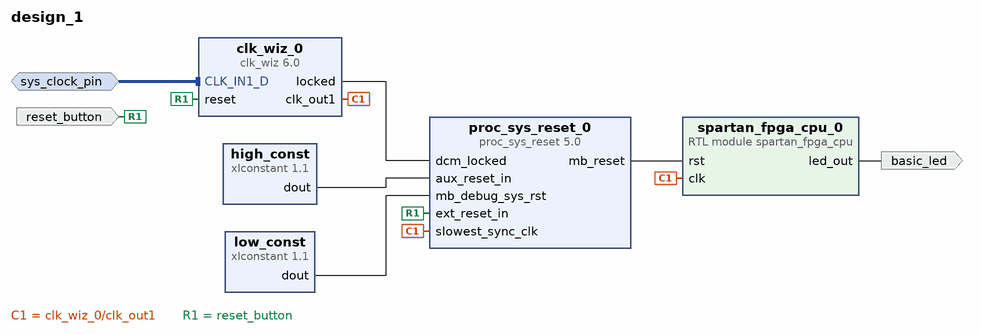
[diagram p0: block diagram of the top level]
# Vivado block design design_1, xc7s100fgga676-2, Vivado 2024.1
create_bd_design design_1

create_bd_intf_port -mode Slave -vlnv xilinx.com:interface:diff_clock_rtl:1.0 sys_clock_pin
set_property -dict {CONFIG.FREQ_HZ 200000000} [get_bd_intf_ports sys_clock_pin]
create_bd_port -dir I -type rst reset_button
set_property -dict {CONFIG.POLARITY ACTIVE_HIGH} [get_bd_ports reset_button]
create_bd_port -dir O basic_led

create_bd_cell -type module -reference spartan_fpga_cpu spartan_fpga_cpu_0
create_bd_cell -type ip -vlnv xilinx.com:ip:clk_wiz:6.0 clk_wiz_0
set_property -dict [list \
  CONFIG.CLK_IN1_BOARD_INTERFACE sys_diff_clock \
  CONFIG.RESET_BOARD_INTERFACE Custom \
  CONFIG.USE_BOARD_FLOW true \
] [get_bd_cells clk_wiz_0]
create_bd_cell -type ip -vlnv xilinx.com:ip:proc_sys_reset:5.0 proc_sys_reset_0
set_property -dict {CONFIG.RESET_BOARD_INTERFACE reset CONFIG.USE_BOARD_FLOW true} [get_bd_cells proc_sys_reset_0]
create_bd_cell -type ip -vlnv xilinx.com:ip:xlconstant:1.1 high_const
create_bd_cell -type ip -vlnv xilinx.com:ip:xlconstant:1.1 low_const
set_property -dict {CONFIG.CONST_VAL 0} [get_bd_cells low_const]

# ---- connections ----

connect_bd_intf_net -intf_net sys_diff_clock_1 [get_bd_intf_ports sys_clock_pin] [get_bd_intf_pins clk_wiz_0/CLK_IN1_D]
connect_bd_net [get_bd_pins clk_wiz_0/clk_out1] [get_bd_pins proc_sys_reset_0/slowest_sync_clk] [get_bd_pins spartan_fpga_cpu_0/clk]
connect_bd_net [get_bd_pins clk_wiz_0/locked] [get_bd_pins proc_sys_reset_0/dcm_locked]
connect_bd_net [get_bd_pins high_const/dout] [get_bd_pins proc_sys_reset_0/aux_reset_in]
connect_bd_net [get_bd_pins low_const/dout] [get_bd_pins proc_sys_reset_0/mb_debug_sys_rst]
connect_bd_net [get_bd_pins proc_sys_reset_0/mb_reset] [get_bd_pins spartan_fpga_cpu_0/rst]
connect_bd_net -net reset_1 [get_bd_ports reset_button] [get_bd_pins proc_sys_reset_0/ext_reset_in] [get_bd_pins clk_wiz_0/reset]
connect_bd_net [get_bd_pins spartan_fpga_cpu_0/led_out] [get_bd_ports basic_led]

validate_bd_design
save_bd_design
